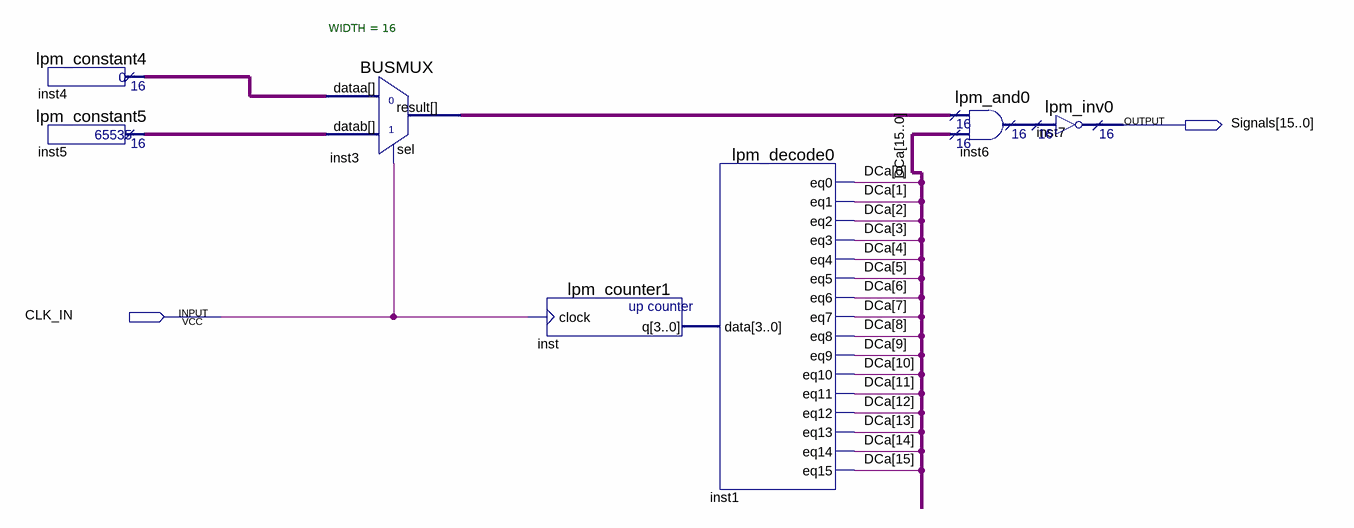
[diagram p0: schematic sheet]
// Quartus schematic RefSignalsGenerator.bdf as structural Verilog: 7 symbols, 2 pins
module RefSignalsGenerator (
  input  CLK_IN,
  output [15:0] Signals
);

  wire [3:0] inst_q;
  wire [15:0] DCa, inst3_result, inst4_result, inst5_result, inst6_result;

  lpm_constant4 inst4 (.result(inst4_result));
  lpm_constant5 inst5 (.result(inst5_result));
  BUSMUX #(.WIDTH(16)) inst3 (.datab(inst5_result), .sel(CLK_IN), .dataa(inst4_result), .result(inst3_result));
  lpm_counter1 inst (.clock(CLK_IN), .q(inst_q));
  lpm_decode0 inst1 (
    .data(inst_q), .eq0(DCa[0]), .eq1(DCa[1]), .eq2(DCa[2]), .eq3(DCa[3]), .eq4(DCa[4]), .eq5(DCa[5]),
    .eq6(DCa[6]), .eq7(DCa[7]), .eq8(DCa[8]), .eq9(DCa[9]), .eq10(DCa[10]), .eq11(DCa[11]), .eq12(DCa[12]),
    .eq13(DCa[13]), .eq14(DCa[14]), .eq15(DCa[15]));
  lpm_and0 inst6 (.data0x(inst3_result), .data1x(DCa), .result(inst6_result));
  lpm_inv0 inst7 (.data(inst6_result), .result(Signals));
endmodule
